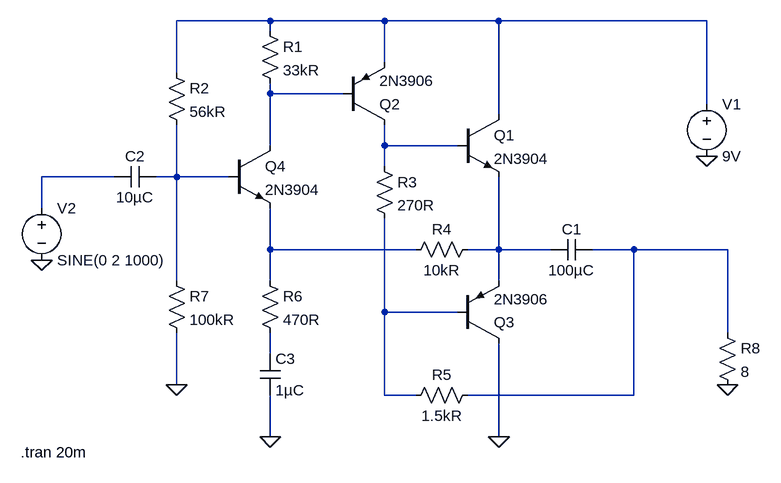
[diagram p0: schematic simulation.asc]
simulation.asc, the LTspice schematic file:
Version 4.1
SHEET 1 880 680
WIRE -352 -336 -496 -336
WIRE -176 -336 -352 -336
WIRE 0 -336 -176 -336
WIRE 320 -336 0 -336
WIRE -352 -320 -352 -336
WIRE -176 -272 -176 -336
WIRE -496 -256 -496 -336
WIRE -352 -224 -352 -240
WIRE -240 -224 -352 -224
WIRE 320 -208 320 -336
WIRE 0 -192 0 -336
WIRE -352 -144 -352 -224
WIRE -176 -144 -176 -176
WIRE -64 -144 -176 -144
WIRE -176 -112 -176 -144
WIRE -592 -96 -704 -96
WIRE -496 -96 -496 -176
WIRE -496 -96 -528 -96
WIRE -416 -96 -496 -96
WIRE -704 -48 -704 -96
WIRE -352 16 -352 -48
WIRE -128 16 -352 16
WIRE 0 16 0 -96
WIRE 0 16 -48 16
WIRE 80 16 0 16
WIRE 208 16 144 16
WIRE 352 16 208 16
WIRE -496 64 -496 -96
WIRE -352 64 -352 16
WIRE 0 64 0 16
WIRE -176 112 -176 -32
WIRE -64 112 -176 112
WIRE 352 144 352 16
WIRE -352 176 -352 144
WIRE -496 224 -496 144
WIRE -176 240 -176 112
WIRE -128 240 -176 240
WIRE 208 240 208 16
WIRE 208 240 -48 240
WIRE -352 304 -352 240
WIRE 0 304 0 160
FLAG 320 -128 0
FLAG -704 32 0
FLAG -496 224 0
FLAG -352 304 0
FLAG 0 304 0
FLAG 352 224 0
SYMBOL voltage 320 -224 R0
WINDOW 123 0 0 Left 0
WINDOW 39 0 0 Left 0
SYMATTR InstName V1
SYMATTR Value 9V
SYMBOL npn -64 -192 R0
SYMATTR InstName Q1
SYMATTR Value 2N3904
SYMBOL npn -416 -144 R0
SYMATTR InstName Q4
SYMATTR Value 2N3904
SYMBOL res -368 -336 R0
SYMATTR InstName R1
SYMATTR Value 33kR
SYMBOL res -512 -272 R0
SYMATTR InstName R2
SYMATTR Value 56kR
SYMBOL res -192 -128 R0
SYMATTR InstName R3
SYMATTR Value 270R
SYMBOL res -32 0 R90
WINDOW 0 0 56 VBottom 2
WINDOW 3 32 56 VTop 2
SYMATTR InstName R4
SYMATTR Value 10kR
SYMBOL cap 144 0 R90
WINDOW 0 0 32 VBottom 2
WINDOW 3 32 32 VTop 2
SYMATTR InstName C1
SYMATTR Value 100µC
SYMBOL res -32 224 R90
WINDOW 0 0 56 VBottom 2
WINDOW 3 32 56 VTop 2
SYMATTR InstName R5
SYMATTR Value 1.5kR
SYMBOL cap -528 -112 R90
WINDOW 0 0 32 VBottom 2
WINDOW 3 32 32 VTop 2
SYMATTR InstName C2
SYMATTR Value 10µC
SYMBOL res -368 48 R0
SYMATTR InstName R6
SYMATTR Value 470R
SYMBOL cap -368 176 R0
SYMATTR InstName C3
SYMATTR Value 1µC
SYMBOL res -512 48 R0
SYMATTR InstName R7
SYMATTR Value 100kR
SYMBOL res 336 128 R0
SYMATTR InstName R8
SYMATTR Value 8
SYMBOL voltage -704 -64 R0
WINDOW 123 0 0 Left 0
WINDOW 39 0 0 Left 0
SYMATTR InstName V2
SYMATTR Value SINE(0 2 1000)
SYMBOL pnp -240 -176 M180
SYMATTR InstName Q2
SYMATTR Value 2N3906
SYMBOL pnp -64 160 M180
SYMATTR InstName Q3
SYMATTR Value 2N3906
TEXT -736 328 Left 2 !.tran 20m

The netlist it stands for:
* simulation.asc
V1 N001 0 9V
Q1 N001 N003 N007 0 2N3904
Q4 N002 N005 N006 0 2N3904
R1 N001 N002 33kR
R2 N001 N005 56kR
R3 N003 N009 270R
R4 N007 N006 10kR
C1 N008 N007 100µC
R5 N008 N009 1.5kR
C2 N005 N004 10µC
R6 N006 N010 470R
C3 N010 0 1µC
R7 N005 0 100kR
R8 N008 0 8
V2 N004 0 SINE(0 2 1000)
Q2 N003 N002 N001 0 2N3906
Q3 0 N009 N007 0 2N3906
.model NPN NPN
.model PNP PNP
.lib standard.bjt
.tran 20m
.backanno
.end